# EAGLE schematic schematic (EAGLE 7.5.0)
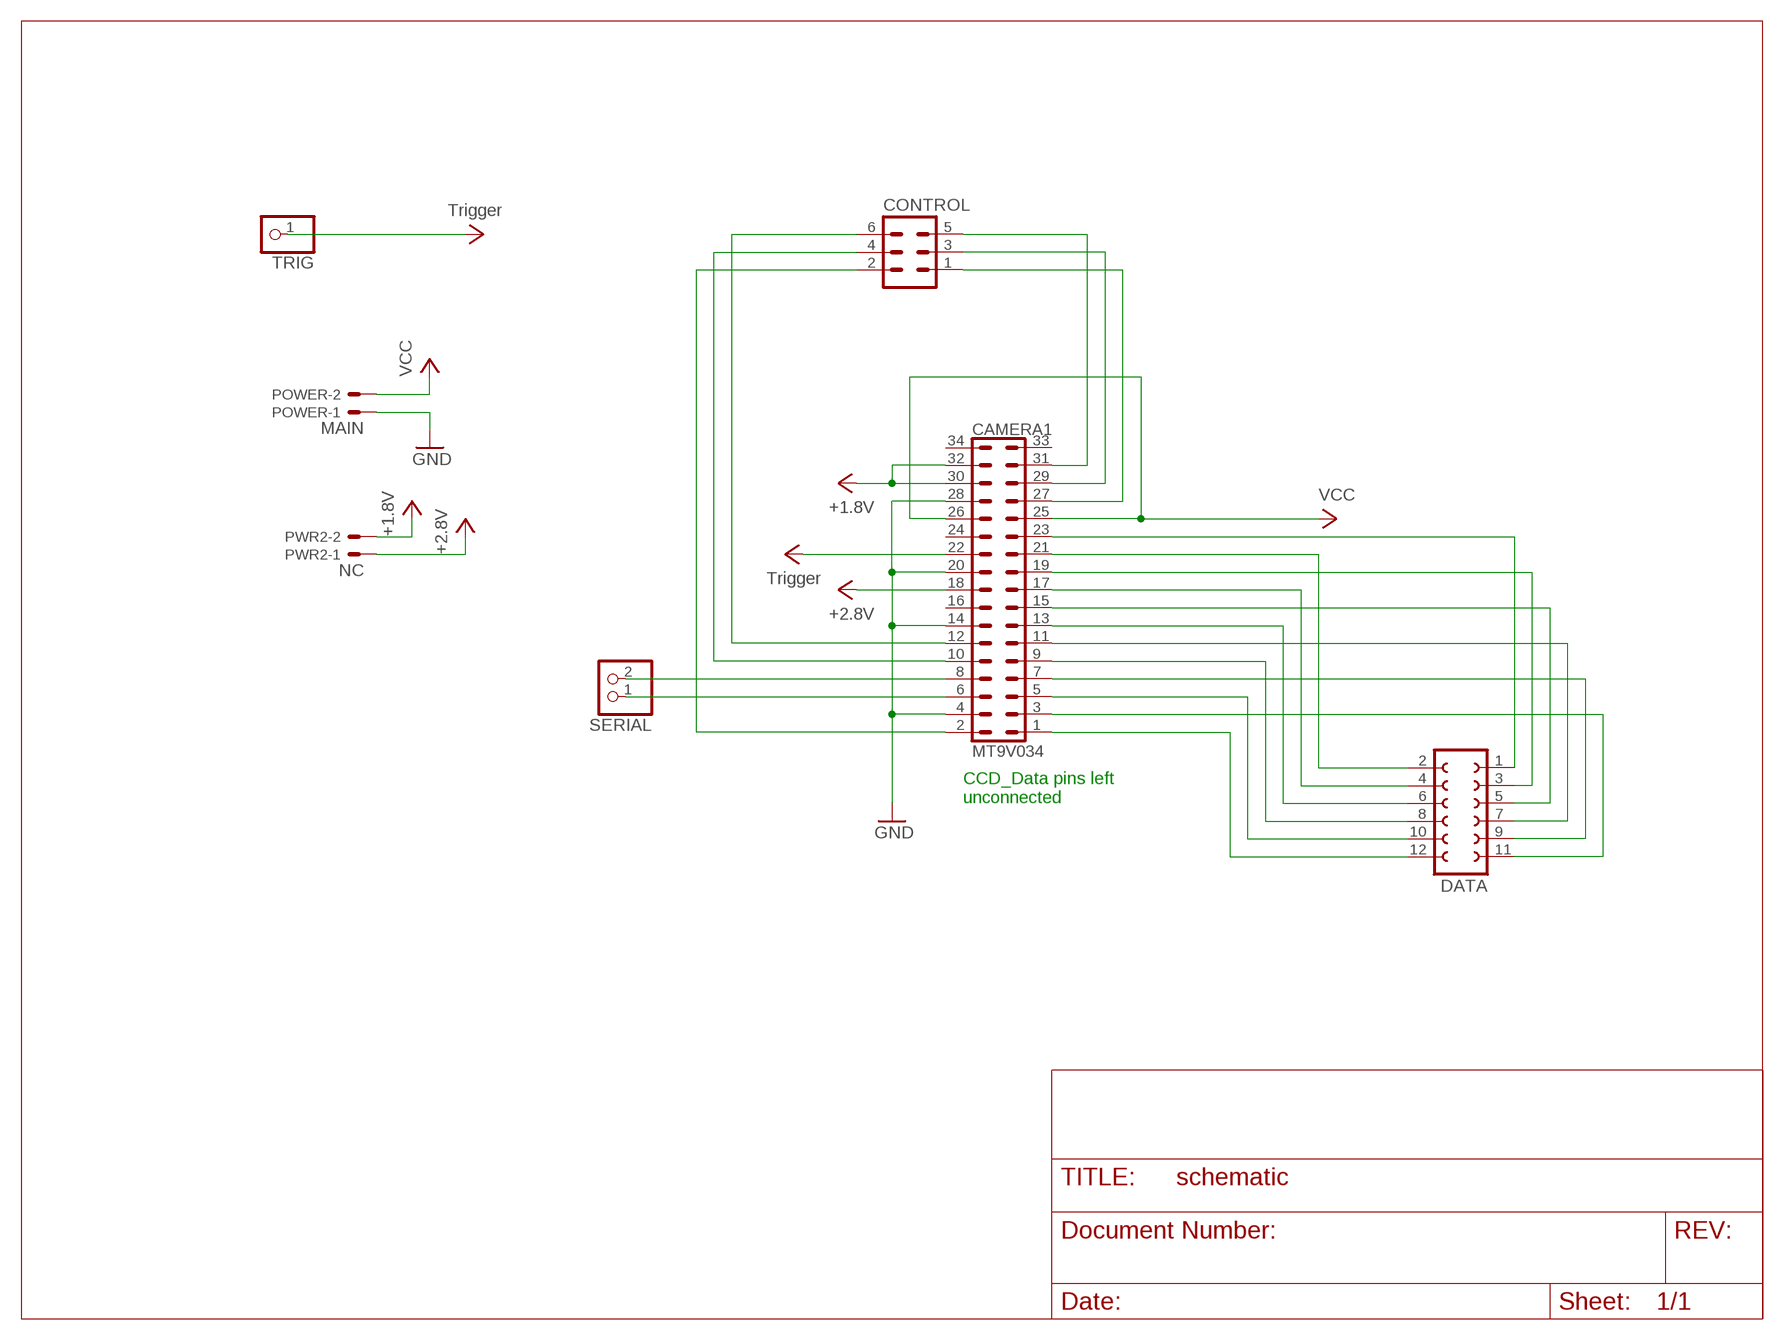
[diagram p0: schematic, sheet 1]

## Parts
CAMERA1  MT9V034  PHB_1MM27_2X17_SNT  [PHB_1MM27_2X17_SNT]
CONTROL  MA03-2  [MA03-2]
DATA  FE06-2  [FE06-2]
POWER  MAIN  22-23-2021  [22-23-2021]
PWR2  NC  22-23-2021  [22-23-2021]
SERIAL  PINHD-1X2  [1X02]
TRIG  PINHD-1X1  [1X01]

## Nets
1.8V: CAMERA1.30 CAMERA1.32 PWR2.2 ; supply symbol labelled +1.8V
2.8V: CAMERA1.18 PWR2.1 ; supply symbol labelled +2.8V
GND: CAMERA1.4 CAMERA1.14 CAMERA1.20 CAMERA1.28 POWER.1
N$1: CAMERA1.23 DATA.1
N$2: CAMERA1.21 DATA.2
N$3: CAMERA1.19 DATA.3
N$4: CAMERA1.17 DATA.4
N$5: CAMERA1.15 DATA.5
N$6: CAMERA1.13 DATA.6
N$7: CAMERA1.11 DATA.7
N$8: CAMERA1.9 DATA.8
N$9: CAMERA1.7 DATA.9
N$10: CAMERA1.5 DATA.10
N$11: CAMERA1.3 DATA.11
N$12: CAMERA1.1 DATA.12
N$13: CAMERA1.12 CONTROL.6
N$14: CAMERA1.10 CONTROL.4
N$15: CAMERA1.2 CONTROL.2
N$16: CAMERA1.31 CONTROL.5
N$17: CAMERA1.29 CONTROL.3
N$18: CAMERA1.27 CONTROL.1
N$23: CAMERA1.8 SERIAL.2
N$24: CAMERA1.6 SERIAL.1
TRIGGER: CAMERA1.22 TRIG.1 ; supply symbol labelled Trigger
VCC: CAMERA1.25 CAMERA1.26 POWER.2
Unconnected: CAMERA1.16 CAMERA1.24 CAMERA1.33 CAMERA1.34

## Notes on the sheet
- CCD_Data pins left
  unconnected

## Library data of the parts
CAMERA1 = _hhn_con_pinhead_box_1mm27:PHB_1MM27_2X17_*: Pin Header Box-Type, 1.27mm/0.5"/50mil Pitch, 2x17 Circuits Note: see library description for an important note about THT-version
CONTROL = con-lstb:MA03-2: PIN HEADER; OC_FARNELL: unknown; OC_NEWARK: unknown
DATA = con-lsta:FE06-2: FEMALE HEADER; OC_FARNELL: unknown; OC_NEWARK: unknown
POWER PWR2 = con-molex:22-23-2021: .100" (2.54mm) Center Header - 2 Pin; MF: MOLEX; MPN: 22-23-2021; OC_FARNELL: 1462926; OC_NEWARK: 25C3832
SERIAL = pinhead:PINHD-1X2: PIN HEADER
TRIG = pinhead:PINHD-1X1: PIN HEADER